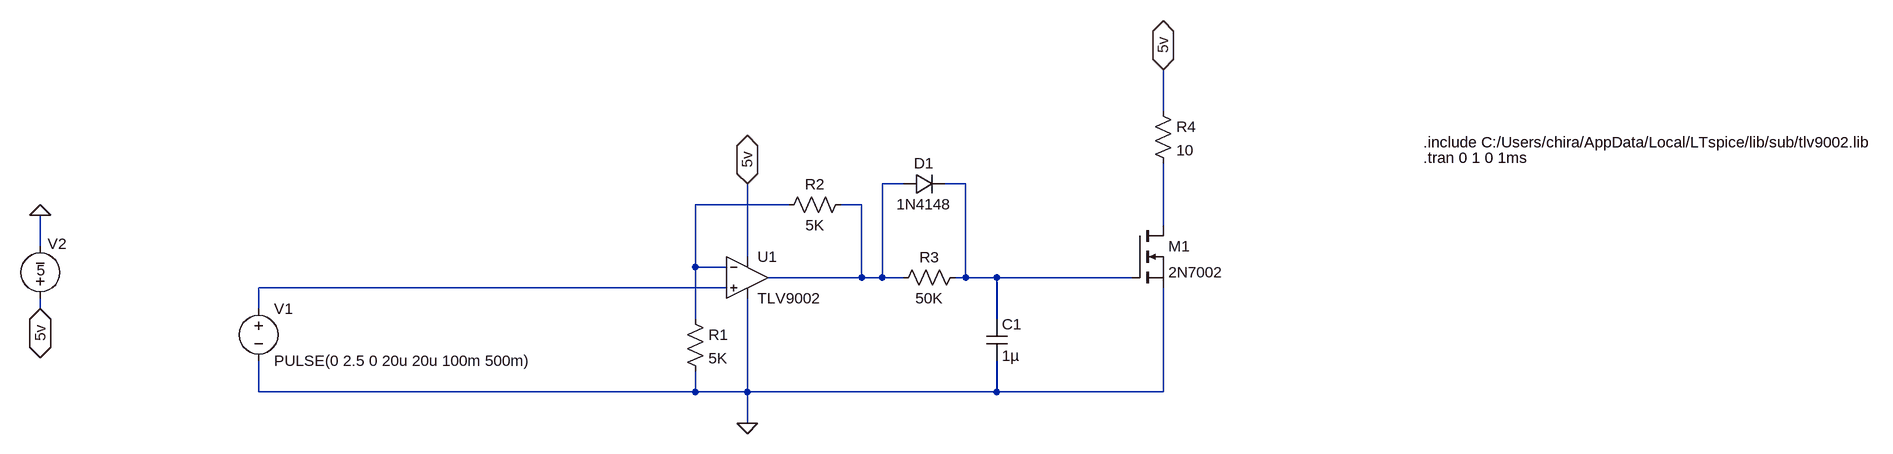
[diagram p0: schematic test-se-to-nmos.asc]
test-se-to-nmos.asc, the LTspice schematic file:
Version 4.1
SHEET 1 1804 680
WIRE 608 -160 608 -224
WIRE 208 -48 176 -48
WIRE 304 -48 272 -48
WIRE 32 -16 -112 -16
WIRE 144 -16 112 -16
WIRE 608 16 608 -80
WIRE -1120 48 -1120 0
WIRE -32 64 -32 -48
WIRE -112 80 -112 -16
WIRE -64 80 -112 80
WIRE 144 96 144 -16
WIRE 144 96 0 96
WIRE 176 96 176 -48
WIRE 176 96 144 96
WIRE 208 96 176 96
WIRE 304 96 304 -48
WIRE 304 96 288 96
WIRE 352 96 304 96
WIRE 560 96 352 96
WIRE -64 112 -784 112
WIRE -1120 144 -1120 128
WIRE -784 144 -784 112
WIRE -112 160 -112 80
WIRE 352 160 352 96
WIRE -784 272 -784 224
WIRE -112 272 -112 240
WIRE -112 272 -784 272
WIRE -32 272 -32 128
WIRE -32 272 -112 272
WIRE 352 272 352 224
WIRE 352 272 -32 272
WIRE 608 272 608 112
WIRE 608 272 352 272
WIRE -32 320 -32 272
FLAG -32 -48 5v
IOPIN -32 -48 BiDir
FLAG -32 320 0
FLAG -1120 0 0
FLAG -1120 144 5v
IOPIN -1120 144 BiDir
FLAG 608 -224 5v
IOPIN 608 -224 BiDir
SYMBOL OpAmps\\TLV9002 -32 32 R0
SYMATTR InstName U1
SYMBOL res -128 144 R0
SYMATTR InstName R1
SYMATTR Value 5K
SYMBOL res 128 -32 R90
WINDOW 0 0 56 VBottom 2
WINDOW 3 32 56 VTop 2
SYMATTR InstName R2
SYMATTR Value 5K
SYMBOL cap 336 160 R0
SYMATTR InstName C1
SYMATTR Value 1µ
SYMATTR SpiceLine V=10 Irms=0 Rser=0.0099 Lser=328p
SYMBOL res 192 112 R270
WINDOW 0 32 56 VTop 2
WINDOW 3 0 56 VBottom 2
SYMATTR InstName R3
SYMATTR Value 50K
SYMBOL diode 208 -32 R270
WINDOW 0 32 32 VTop 2
WINDOW 3 0 32 VBottom 2
SYMATTR InstName D1
SYMATTR Value 1N4148
SYMBOL voltage -784 128 R0
WINDOW 123 0 0 Left 0
WINDOW 39 0 0 Left 0
SYMATTR InstName V1
SYMATTR Value PULSE(0 2.5 0 20u 20u 100m 500m)
SYMBOL voltage -1120 144 R180
WINDOW 0 -41 100 Left 2
WINDOW 3 -8 59 Left 2
WINDOW 123 0 0 Left 0
WINDOW 39 0 0 Left 0
SYMATTR InstName V2
SYMATTR Value 5
SYMBOL nmos 560 16 R0
SYMATTR InstName M1
SYMATTR Value 2N7002
SYMBOL res 592 -176 R0
SYMATTR InstName R4
SYMATTR Value 10
TEXT 1008 -88 Left 2 !.tran 0 1 0 1ms
TEXT 1008 -112 Left 2 !.include C:/Users/chira/AppData/Local/LTspice/lib/sub/tlv9002.lib

The netlist it stands for:
* test-se-to-nmos.asc
X§U1 N005 N003 5v 0 N001 TLV9002  ; pins In+ In- V+ V- OUT
R1 N003 0 5K
R2 N001 N003 5K
C1 N002 0 1µ V=10 Irms=0 Rser=0.0099 Lser=328p
R3 N001 N002 50K
D1 N001 N002 1N4148
V1 N005 0 PULSE(0 2.5 0 20u 20u 100m 500m)
V2 5v 0 5
M1 N004 N002 0 0 2N7002
R4 5v N004 10
.model D D
.lib standard.dio
.model NMOS NMOS
.model PMOS PMOS
.lib standard.mos
.tran 0 1 0 1ms
.include C:/Users/chira/AppData/Local/LTspice/lib/sub/tlv9002.lib
.backanno
.end